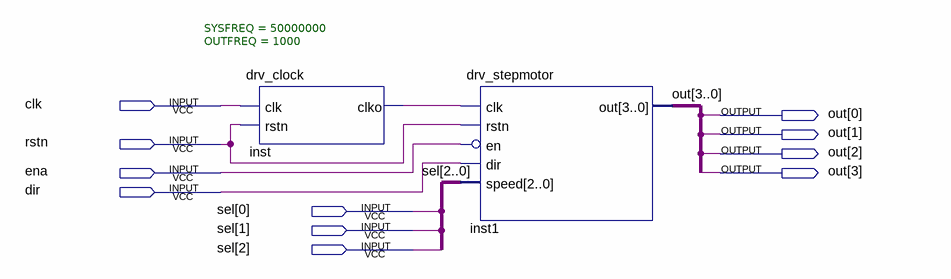
[diagram p0: schematic sheet]
// Quartus schematic dig2lab4.bdf as structural Verilog: 2 symbols, 11 pins
module dig2lab4 (
  input  clk,
  input  rstn,
  input  ena,
  input  dir,
  input  [2:0] sel,
  output [3:0] out
);

  wire inst_clko;

  drv_clock #(.SYSFREQ(50000000), .OUTFREQ(1000)) inst (.clk(clk), .rstn(rstn), .clko(inst_clko));
  drv_stepmotor inst1 (.clk(inst_clko), .rstn(rstn), .en(~ena), .dir(dir), .speed(sel), .out(out));
endmodule
